# EAGLE design Feinstaubsensor_w (EAGLE 7.3.0)
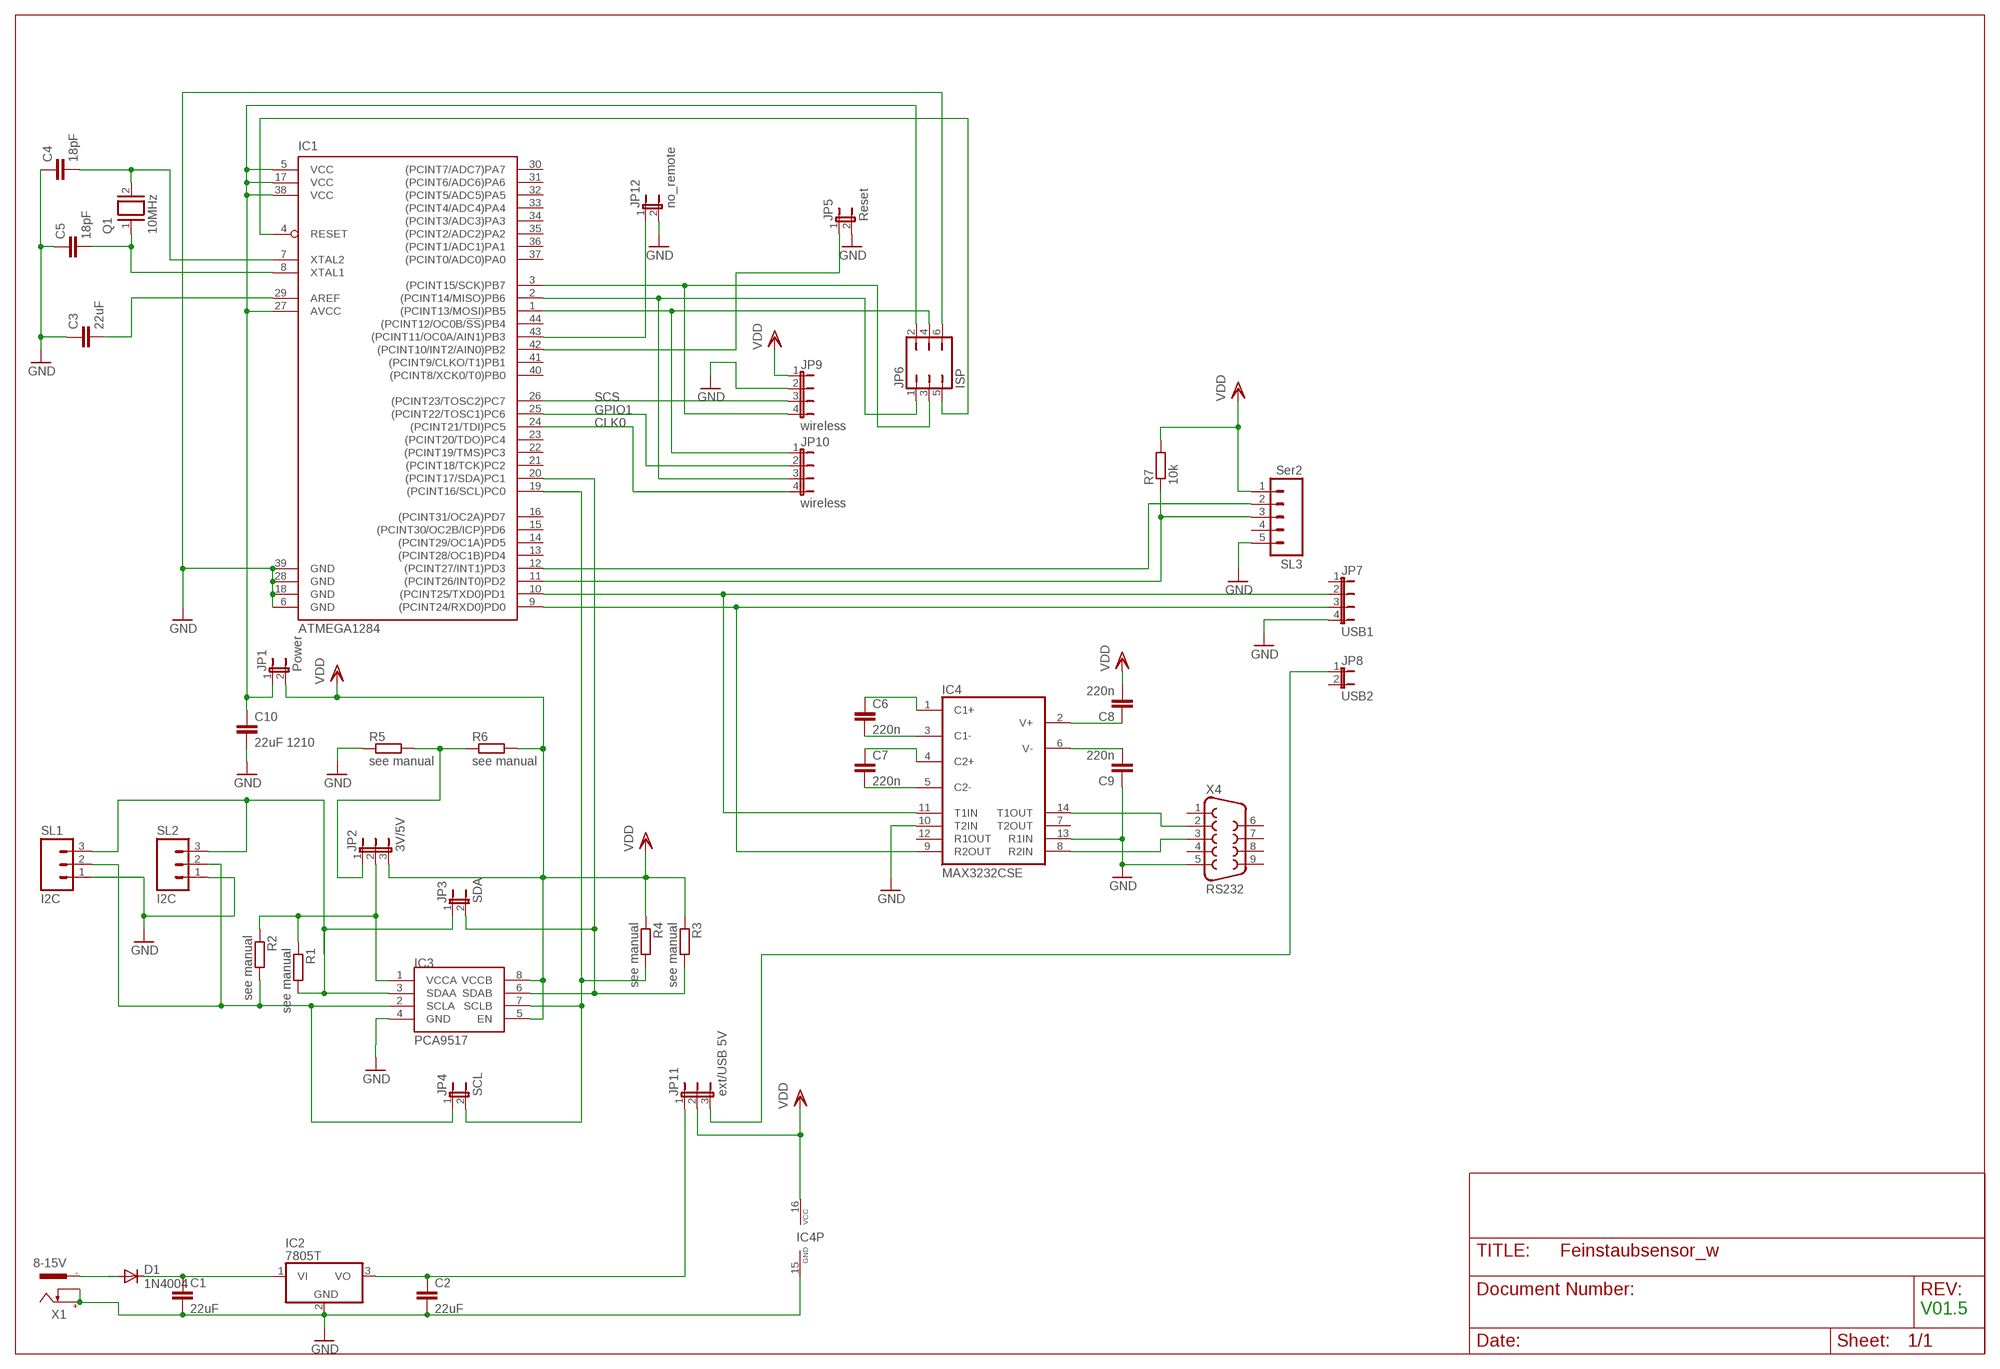
[diagram p0: schematic, sheet 1]

## Parts
C1  22uF  C-EUC1206  [C1206]
C2  22uF  C-EUC1206  [C1206]
C3  22uF  C-EUC1206  [C1206]
C4  18pF  C-EU025-025X050  [C025-025X050]
C5  18pF  C-EU025-025X050  [C025-025X050]
C6  220n  C-EUC1206  [C1206]
C7  220n  C-EUC1206  [C1206]
C8  220n  C-EUC1206  [C1206]
C9  220n  C-EUC1206  [C1206]
C10  22uF 1210  C-EUC1206  [C1206]
D1  1N4004  [DO41-10]
IC1  ATMEGA1284  ATMEGA644A  [TQFP44]
IC2  7805T  [TO220H]
IC3  PCA9517  [SO-08]
IC4  MAX3232CSE  [SO16]
JP1  Power  JP1E  [JP1]
JP2  3V/5V  JP2E  [JP2]
JP3  SDA  JP1E  [JP1]
JP4  SCL  JP1E  [JP1]
JP5  Reset  JP1E  [JP1]
JP6  ISP  JP3Q  [JP3Q]
JP7  USB1  JP4E  [JP4]
JP8  USB2  JP1E  [JP1]
JP9  wireless  JP4E  [JP4]
JP10  wireless  JP4E  [JP4]
JP11  ext/USB 5V  JP2E  [JP2]
JP12  no_remote  JP1E  [JP1]
Q1  10MHz  XTAL/S  [QS]
R1  see manual  R-EU_R1206  [R1206]
R2  see manual  R-EU_R1206  [R1206]
R3  see manual  R-EU_R1206  [R1206]
R4  see manual  R-EU_R1206  [R1206]
R5  see manual  R-EU_R1206  [R1206]
R6  see manual  R-EU_R1206  [R1206]
R7  10k  R-EU_R1206  [R1206]
SL1  I2C  M03  [03P]
SL2  I2C  M03  [03P]
SL3  Ser2  M05  [05P]
X1  8-15V  737992-55  [737992-5]
X4  RS232  F09H  [F09H]

## Nets
C13: C6.1 IC4.1(C1+)
CLK0: IC1.24((PCINT21/TDI)PC5) JP10.4
GND: C1.2 C2.2 C3.1 C4.1 C5.1 C9.1 C10.2 IC1.6(GND) IC1.18(GND) IC1.28(GND) IC1.39(GND) IC2.2(GND) IC3.4(GND) IC4.10(T2IN) IC4.13(R1IN) IC4.15(GND) JP5.2 JP6.6 JP7.4 JP9.2 JP12.2 R5.1 SL1.1 SL2.1 SL3.5 X1.+ X1.K X4.5
GPIO1: IC1.25((PCINT22/TOSC1)PC6) JP10.2
N$2: IC1.9((PCINT24/RXD0)PD0) IC4.9(R2OUT) JP7.3
N$3: C7.2 IC4.5(C2-)
N$4: JP2.1 R5.2 R6.1
N$5: IC1.20((PCINT17/SDA)PC1) IC3.6(SDAB) JP3.2 R3.2
N$7: C10.1 IC1.5(VCC) IC1.17(VCC) IC1.27(AVCC) IC1.38(VCC) JP1.1 JP6.2
N$8: C4.2 IC1.7(XTAL2) Q1.2
N$9: IC1.1((PCINT13/MOSI)PB5) JP6.4 JP10.1
N$10: IC4.14(T1OUT) X4.2
N$11: IC1.12((PCINT27/INT1)PD3) SL3.2
N$12: IC1.10((PCINT25/TXD0)PD1) IC4.11(T1IN) JP7.2
N$13: C7.1 IC4.4(C2+)
N$14: C6.2 IC4.3(C1-)
N$15: IC1.42((PCINT10/INT2/AIN0)PB2) JP5.1
N$16: C8.1 IC4.2(V+)
N$17: C9.2 IC4.6(V-)
N$18: IC1.4(RESET) JP6.5
N$19: IC1.11((PCINT26/INT0)PD2) R7.1 SL3.3
N$20: IC1.43((PCINT11/OC0A/AIN1)PB3) JP12.1
N$21: C5.2 IC1.8(XTAL1) Q1.1
N$22: IC1.19((PCINT16/SCL)PC0) IC3.7(SCLB) JP4.2 R4.2
N$23: IC3.3(SDAA) JP3.1 R1.2 SL1.3 SL2.3
N$24: C3.2 IC1.29(AREF)
N$25: IC3.2(SCLA) JP4.1 R2.2 SL1.2 SL2.2
N$26: IC1.3((PCINT15/SCK)PB7) JP6.3 JP9.4
N$27: D1.A X1.-1
N$29: IC1.2((PCINT14/MISO)PB6) JP6.1 JP10.3
N$31: C2.1 IC2.3(VO) JP11.1
N$32: IC3.1(VCCA) JP2.2 R1.1 R2.1
N$33: C1.1 D1.C IC2.1(VI)
N$36: JP8.1 JP11.3
N$41: IC4.8(R2IN) X4.3
SCS: IC1.26((PCINT23/TOSC2)PC7) JP9.3
VDD: C8.2 IC3.5(EN) IC3.8(VCCB) IC4.16(VCC) JP1.2 JP2.3 JP9.1 JP11.2 R3.1 R4.1 R6.2 R7.2 SL3.1
Unconnected: IC1.13((PCINT28/OC1B)PD4) IC1.14((PCINT29/OC1A)PD5) IC1.15((PCINT30/OC2B/ICP)PD6) IC1.16((PCINT31/OC2A)PD7) IC1.21((PCINT18/TCK)PC2) IC1.22((PCINT19/TMS)PC3) IC1.23((PCINT20/TDO)PC4) IC1.30((PCINT7/ADC7)PA7) IC1.31((PCINT6/ADC6)PA6) IC1.32((PCINT5/ADC5)PA5) IC1.33((PCINT4/ADC4)PA4) IC1.34((PCINT3/ADC3)PA3) IC1.35((PCINT2/ADC2)PA2) IC1.36((PCINT1/ADC1)PA1) IC1.37((PCINT0/ADC0)PA0) IC1.40((PCINT8/XCK0/T0)PB0) IC1.41((PCINT9/CLKO/T1)PB1) IC1.44((PCINT12/OC0B/!SS!)PB4) IC4.7(T2OUT) IC4.12(R1OUT) JP7.1 JP8.2 SL3.4 X1.-2 X4.1 X4.4 X4.6 X4.7 X4.8 X4.9

## Notes on the sheet
- V01.5

## Library data of the parts
C1-C3 C6-C10 = rcl:C-EU: CAPACITOR, European symbol
C4 C5 = resistor:C-EU: CAPACITOR, European symbol
D1 = diode:1N4004: DIODE general purpose rectifier, 1 A
IC1 = atmel:ATMEGA644: 8-bit Microcontroller with 64K Bytes In-System Programmable Flash Source: http://www.atmel.com/dyn/resources/prod_documents/doc2593.pdf; MPN: ATMEGA644PV-10AU; OC_FARNELL: 1455123; OC_NEWARK: 58M3748
IC2 = linear:78*: Positive VOLTAGE REGULATOR Source: http://cache.national.com/ds/LM/LM78L05.pdf http://www.fairchildsemi.com/ds/LM/LM7805.pdf
IC3 = PCA9517:PCA9517: PCA9517
IC4 = maxim:MAX3232*: True RS-232 Transceivers 3.0V to 5.5V, Low-Power up to 1Mbps, Using Four 0.1µF External Capacitors Source: http://pdfserv.maxim-ic.com/en/ds/MAX3222-MAX3241.pdf; MPN: MAX3232CSE; OC_FARNELL: 9725490; OC_NEWARK: 90C2890
JP1 JP3-JP5 JP8 JP12 = jumper:JP1E: JUMPER
JP2 JP11 = jumper:JP2E: JUMPER
JP6 = jumper:JP3Q: JUMPER
JP7 JP9 JP10 = jumper:JP4E: JUMPER
Q1 = special:XTAL/S: CRYSTAL
R1-R7 = resistor:R-EU_: RESISTOR, European symbol
SL1 SL2 = con-amp-quick:M03: AMP QUICK CONNECTOR; OC_FARNELL: unknown; OC_NEWARK: unknown
SL3 = con-amp-quick:M05: AMP QUICK CONNECTOR; OC_FARNELL: unknown; OC_NEWARK: unknown
X1 = con-conrad:737992-55: FEMALE PRINT CONNECTOR DIN 45323 (34V/3A), ROKA, distributor Conrad
X4 = con-subd:F09: SUB-D; OC_FARNELL: unknown; OC_NEWARK: unknown

## Board
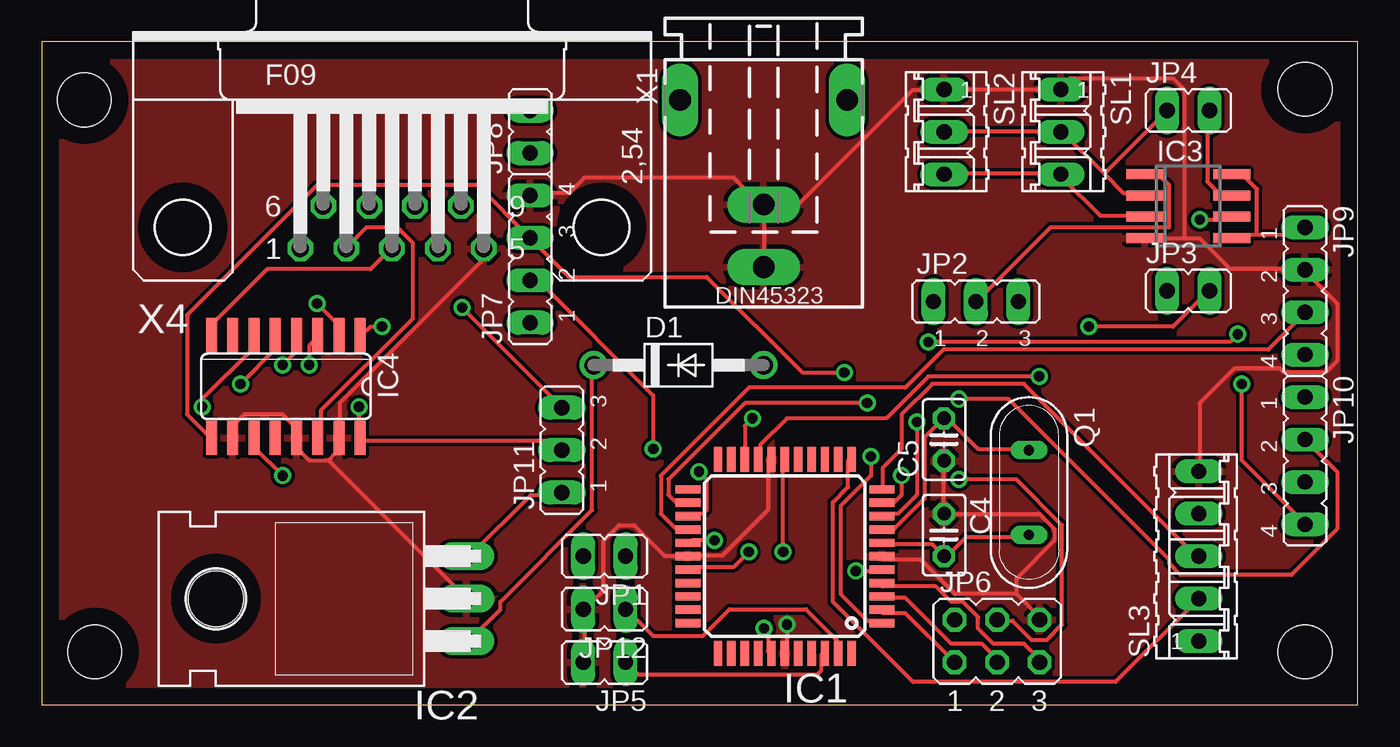
[diagram p1: board, top side]
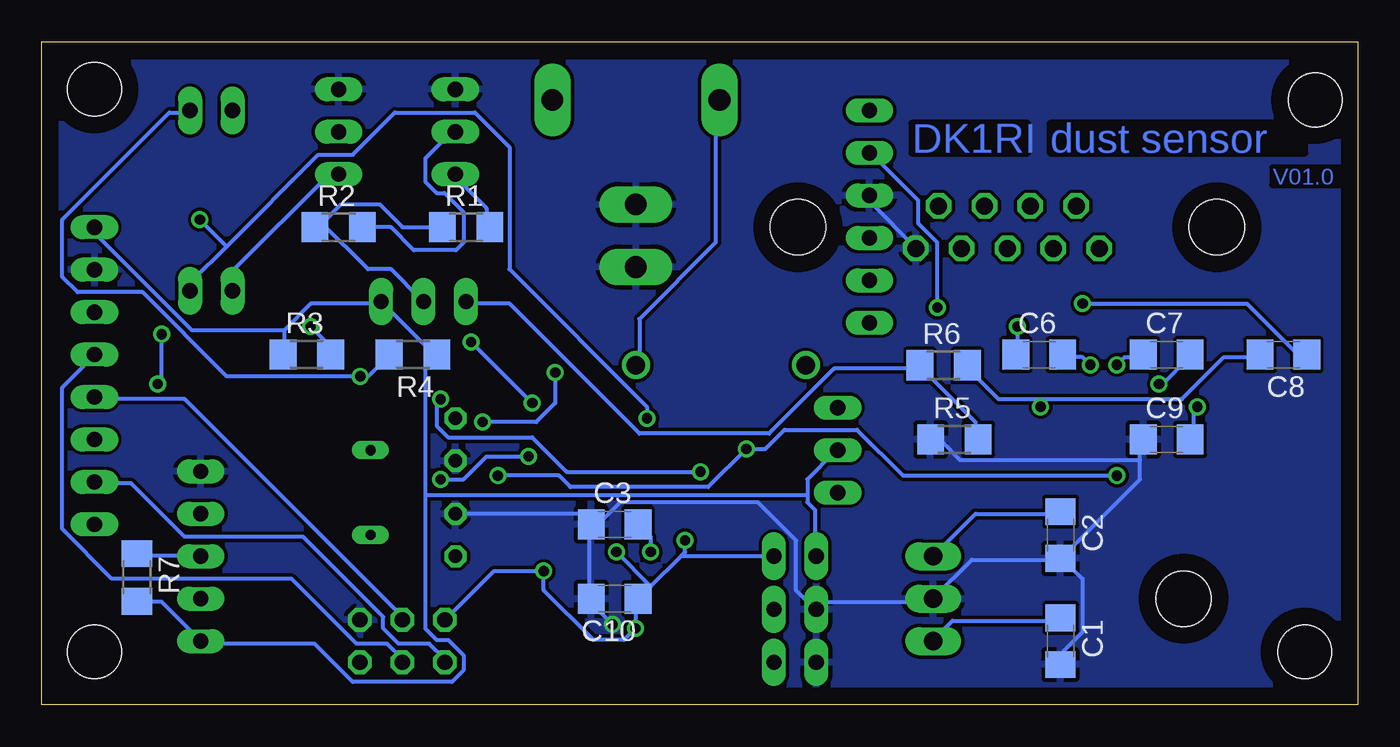
[diagram p2: board, bottom side, seen from below]

Size 78.72 x 39.67 mm. Coordinates in mm from the lower left corner, seen from the top.
Outline: 0,0 78.72,0 78.72,39.67 0,39.67 0,0
Copper layers (1*16): Top 0.035mm / dielectric 1.5mm / Bottom 0.035mm
Design rules "default": minimum track width 10mil, minimum drill 24mil, track to track 8mil, track to pad 8mil, pad to pad 8mil, via to via 8mil, smd to smd 8mil, copper to edge 40mil, drill to drill 8mil, minimum pad ring 10mil, minimum via ring 8mil, stop-mask expansion 4mil, vias tented up to drill 0mil, thermal gap 10mil
Holes 3.2 mm at 75.56,36.83 75.56,3.17 3.17,3.17 2.54,36.2

### Footprints (pad centres in the part's own frame; a part is rotated, then mirrored left to right if it is on the bottom)
C1206 = smd 1.6 x 1.8: 1 -1.4,0; 2 1.4,0
C025-025X050 = drill 0.813 octagon: 1 -1.27,0; 2 1.27,0
DO41-10 = drill 1.118: A 5.08,0; C -5.08,0
TQFP44 = smd 1.5 x 0.5: 1 -5.8,4; 2 -5.8,3.2; 3 -5.8,2.4; 4 -5.8,1.6; 5 -5.8,0.8; 6 -5.8,0; 7 -5.8,-0.8; 8 -5.8,-1.6; 9 -5.8,-2.4; 10 -5.8,-3.2; 11 -5.8,-4; 23 5.8,-4; 24 5.8,-3.2; 25 5.8,-2.4; 26 5.8,-1.6; 27 5.8,-0.8; 28 5.8,0; 29 5.8,0.8; 30 5.8,1.6; 31 5.8,2.4; 32 5.8,3.2; 33 5.8,4 | smd 0.5 x 1.5: 12 -4,-5.8; 13 -3.2,-5.8; 14 -2.4,-5.8; 15 -1.6,-5.8; 16 -0.8,-5.8; 17 0,-5.8; 18 0.8,-5.8; 19 1.6,-5.8; 20 2.4,-5.8; 21 3.2,-5.8; 22 4,-5.8; 34 4,5.8; 35 3.2,5.8; 36 2.4,5.8; 37 1.6,5.8; 38 0.8,5.8; 39 0,5.8; 40 -0.8,5.8; 41 -1.6,5.8; 42 -2.4,5.8; 43 -3.2,5.8; 44 -4,5.8
TO220H = drill 1.118 long: 1 -2.54,-10.16; 2 0,-10.16; 3 2.54,-10.16 | hole 3.302: 0,4.826
SO-08 = smd 0.6 x 2.2: 1 -1.905,-2.6; 2 -0.635,-2.6; 3 0.635,-2.6; 4 1.905,-2.6; 5 1.905,2.6; 6 0.635,2.6; 7 -0.635,2.6; 8 -1.905,2.6
SO16 = smd 0.66 x 2.032: 1 -4.445,-3.073; 2 -3.175,-3.073; 3 -1.905,-3.073; 4 -0.635,-3.073; 5 0.635,-3.073; 6 1.905,-3.073; 7 3.175,-3.073; 8 4.445,-3.073; 9 4.445,3.073; 10 3.175,3.073; 11 1.905,3.073; 12 0.635,3.073; 13 -0.635,3.073; 14 -1.905,3.073; 15 -3.175,3.073; 16 -4.445,3.073
JP1 = drill 0.914 long: 1 0,-1.27; 2 0,1.27
JP2 = drill 0.914 long: 1 -2.54,0; 2 0,0; 3 2.54,0
JP3Q = drill 0.914 octagon: 1 -2.54,-1.27; 2 -2.54,1.27; 3 0,-1.27; 4 0,1.27; 5 2.54,-1.27; 6 2.54,1.27
JP4 = drill 0.914 long: 1 -3.81,0; 2 -1.27,0; 3 1.27,0; 4 3.81,0
QS = drill 0.61 long: 1 -2.54,0; 2 2.54,0
R1206 = smd 1.6 x 1.803: 1 -1.422,0; 2 1.422,0
03P = drill 0.914 long: 1 -2.54,0; 2 0,0; 3 2.54,0
05P = drill 0.914 long: 1 -5.08,0; 2 -2.54,0; 3 0,0; 4 2.54,0; 5 5.08,0
737992-5 = drill 1.3 pad 2.184 long: + 0,10; -1 5,0; -2 -5,0; K 0,6.25
F09H = drill 1.016 octagon: 1 -5.486,-1.27; 2 -2.743,-1.27; 3 0,-1.27; 4 2.743,-1.27; 5 5.486,-1.27; 6 -4.115,1.27; 7 -1.372,1.27; 8 1.372,1.27; 9 4.115,1.27 | hole 3.302: -12.522,0; 12.522,0

### Placement (x,y rotation side)
C1  17.78,3.81 270 bottom
C2  17.78,10.16 270 bottom
C3  44.45,10.79 0 bottom
C4  53.98,10.16 270 top
C5  53.98,15.88 90 top
C6  19.05,20.95 0 bottom
C7  11.43,20.95 0 bottom
C8  4.45,20.95 180 bottom
C9  11.43,15.88 0 bottom
C10  44.45,6.35 180 bottom
D1  38.1,20.32 0 top
IC1  44.45,8.89 180 top
IC2  15.24,6.35 90 top
IC3  68.58,29.84 270 top
IC4  14.61,19.05 180 top
JP1  33.66,8.89 90 top
JP2  55.88,24.13 0 top
JP3  68.58,24.77 270 top
JP4  68.58,35.56 270 top
JP5  33.66,2.54 90 top
JP6  57.15,3.81 0 top
JP7  29.21,26.67 90 top
JP8  29.21,34.29 0 top
JP9  75.56,24.77 270 top
JP10  75.56,14.61 270 top
JP11  31.11,15.24 90 top
JP12  33.66,5.71 90 top
Q1  59.05,12.7 270 top
R1  53.34,28.57 0 bottom
R2  60.96,28.57 0 bottom
R3  62.87,20.95 0 bottom
R4  56.52,20.95 180 bottom
R5  24.13,15.88 0 bottom
R6  24.77,20.32 0 bottom
R7  73.03,7.62 270 bottom
SL1  60.96,34.29 270 top
SL2  53.98,34.29 270 top
SL3  69.22,8.89 90 top
X1  43.18,36.2 180 top
X4  20.95,28.57 0 top

### Tracks (layer width: path | path; a pad name or v marks a point on that pad's centre or on a via)
C13  (via drill 0.61)
  Top 0.254: v20.34,22.63 19.66,22.63 19.2,22.17 IC4.1
  Bottom 0.254: v20.34,22.63 20.34,21.03 C6.1
CLK0  (via drill 0.61)
  Top 0.254: v49.38,18.06 42.06,18.06 37.49,13.49 37.49,12.57 37.95,12.12 38.63,12.12 IC1.24 | v53.03,21.72 71.09,21.72 v71.55,22.17 | v71.78,19.2 71.78,14.63 75.44,10.97 JP10.4
  Bottom 0.254: v53.03,21.72 v49.38,18.06 | v71.55,22.17 71.55,19.43 v71.78,19.2
GND  (via drill 0.61)
  Top 0.254: 58.29,6.63 54.63,6.63 52.58,8.69 50.29,8.69 IC1.6 | 58.29,6.63 59.66,5.26 JP6.6 | C5.1 53.95,14.4 53.95,11.43 C4.1 59.66,11.43 60.58,10.52 60.58,9.83 58.29,7.54 58.29,6.63 | v44.58,4.8 44.58,3.2 IC1.39 | IC1.18 43.43,14.63 43.43,11.66 40.69,8.91 38.86,8.91 IC1.28 38.63,8.91 37.26,8.91 35.43,10.74 34.52,10.74 33.6,9.83 33.6,6.86 32.46,5.71 | IC4.10 11.43,16.69 12.12,17.37 14.4,17.37 15.09,16.69 15.09,16 IC4.13 15.32,15.77 15.32,15.32 16,14.63 17.14,14.63 | 17.14,14.63 17.6,15.09 17.6,15.77 IC4.15 17.83,16 17.83,18.06 26.29,26.52 26.29,27.2 X4.5 | 32.46,5.71 32.46,2.74 JP5.2 | 17.14,14.63 25.38,6.4 IC2.2 | 32.46,5.71 JP12.2 | 68.35,27.89 69.27,27.89 71.09,26.06 75.44,26.06 JP9.2 75.67,25.83 77.5,24 77.5,20.57 76.81,19.89 74.3,19.89 74.07,20.12 71.32,20.12 69.27,18.06 69.27,14.17 SL3.5 | 68.35,27.89 66.06,27.89 IC3.4 | X1.+ 43.2,26.29 43.2,29.72 X1.K | JP7.4 29.26,30.63 31.55,30.63 32.46,31.55 41.38,31.55 42.98,29.95 X1.K | X1.K 43.2,29.95 45.26,29.95 52.12,36.8 53.95,36.8 SL2.1 54.18,36.8 60.81,36.8 SL1.1 61.04,37.03 61.49,37.49 67.67,37.49 68.35,36.8 68.35,27.89
  Bottom 0.254: v44.58,4.8 45.95,6.17 C10.2 45.95,6.4 45.95,10.74 C3.1 | C4.1 46.41,11.43 45.95,10.97 C3.1 | C1.2 17.6,2.52 17.6,3.2 16.46,4.34 16.46,7.54 17.6,8.69 C2.2 | 13.03,14.63 13.03,13.49 17.6,8.91 C2.2 | 13.03,14.63 13.03,15.77 C9.1 | 13.03,14.63 23.77,14.63 24.92,15.77 25.38,15.77 R5.1 | C2.2 17.83,8.69 23.09,8.69 25.38,6.4 IC2.2 25.6,6.17 31.77,6.17 32.23,5.71 JP12.2 32.46,5.71 33.6,6.86 33.6,9.83 35.89,12.12 44.12,12.12 45.26,10.97 45.72,10.97 C3.1 | JP7.4 29.03,30.4 29.03,29.95 26.52,27.43 X4.5
  pour Top: 0.64,38.73 78.11,38.73 78.11,0.64 0.64,0.64
  pour Bottom: 0.64,38.73 78.11,38.73 78.11,0.64 0.64,0.64
GPIO1  (via drill 0.61)
  Top 0.254: v39.32,13.95 39.78,13.49 39.78,11.66 39.55,11.43 38.86,11.43 IC1.25 | v54.86,18.29 57.84,18.29 67.44,8.69 67.44,8.46 68.12,7.77 74.75,7.77 77.5,10.52 77.5,13.95 JP10.2
  Bottom 0.254: v39.32,13.95 47.32,13.95 49.38,16 54.41,16 55.09,16.69 55.09,18.06 v54.86,18.29
N$2  (via drill 0.61)
  Top 0.254: v52.35,16.92 52.35,12.57 51.21,11.43 50.29,11.43 IC1.9 | v48.01,19.89 45.49,19.89 39.78,25.6 31.55,25.6 JP7.3 26.06,31.09 16.46,31.09 8.69,23.32 8.69,17.37 10.06,16 IC4.9
  Bottom 0.254: v52.35,16.92 49.15,16.92 48.01,18.06 v48.01,19.89
N$3  (via drill 0.61)
  Top 0.254: v11.89,19.2 13.95,21.26 13.95,21.95 IC4.5
  Bottom 0.254: v11.89,19.2 11.66,19.2 10.06,20.8 C7.2
N$4
  Bottom 0.254: R5.2 22.86,16 22.86,16.92 26.06,20.12 R6.1 26.29,20.12 31.32,20.12 35.2,16.23 42.98,16.23 50.75,24 53.26,24 JP2.1
N$5  (via drill 0.61)
  Top 0.254: v42.52,17.14 42.06,16.69 42.06,14.86 IC1.20 | v62.64,22.63 67.67,22.63 69.72,24.69 JP3.2 | v69.27,29.03 71.09,29.03 IC3.6
  Bottom 0.254: v42.52,17.14 42.52,17.83 50.75,26.06 50.75,33.38 52.81,35.43 57.61,35.43 60.12,32.92 62.18,32.92 67.67,27.43 | 67.67,27.43 69.72,25.38 69.72,24.92 JP3.2 | v62.64,22.63 61.49,21.49 61.49,21.03 R3.2 | 67.67,27.43 v69.27,29.03
N$7  (via drill 0.61)
  Top 0.254: v48.69,8 50.06,8 IC1.5 | v40.23,9.83 38.86,9.83 IC1.27 | v43.2,4.57 43.43,4.34 43.43,3.2 IC1.38 | v44.35,9.14 44.35,14.63 IC1.17
  Bottom 0.254: JP6.2 54.41,5.26 51.66,8 v48.69,8 48.69,6.86 45.72,3.89 43.89,3.89 v43.2,4.57 43.2,6.17 C10.1 | v40.23,9.83 40.23,9.14 40.46,8.91 | 42.29,7.09 42.98,6.4 C10.1 | 42.29,7.09 40.46,8.91 | 42.29,7.09 v44.35,9.14 | 42.29,7.09 C10.1 | 40.46,8.91 34.98,8.91 JP1.1
N$8
  Top 0.254: IC1.7 50.29,9.6 53.26,9.6 C4.2 54.18,8.91 55.32,10.06 58.98,10.06 Q1.2
N$9  (via drill 0.61)
  Top 0.254: v49.61,14.86 49.61,13.72 47.78,11.89 47.78,6.63 49.38,5.03 50.06,5.03 IC1.1 | v54.86,13.49 58.29,13.49 61.04,10.74 61.04,4.8 60.12,3.89 59.21,3.89 58.06,5.03 57.15,5.03 JP6.4
  Bottom 0.254: v49.61,14.86 52.12,14.86 53.49,13.49 v54.86,13.49 | JP10.1 75.44,18.29 70.18,18.29 57.15,5.26 JP6.4
N$10
  Top 0.254: IC4.14 16.69,16 16.69,17.6 22.17,23.09 22.17,27.66 21.26,28.57 19.43,28.57 18.29,27.43 X4.2
N$11
  Top 0.254: SL3.2 64.24,1.37 52.12,1.37 47.32,6.17 47.32,12.12 48.23,13.03 48.23,14.63 IC1.12
N$12  (via drill 0.61)
  Top 0.254: v51.44,13.72 51.44,12.57 50.98,12.12 50.29,12.12 IC1.10 | v36.58,15.32 36.58,18.52 29.72,25.38 29.26,25.38 JP7.2 | v14.4,13.72 12.8,15.32 12.8,15.77 IC4.11
  Bottom 0.254: v51.44,13.72 47.78,13.72 47.09,13.03 38.86,13.03 v36.58,15.32 35.43,15.32 34.29,16.46 29.95,16.46 27.2,13.72 v14.4,13.72
N$13  (via drill 0.61)
  Top 0.254: v14.4,20.34 15.09,21.03 15.09,21.95 IC4.4
  Bottom 0.254: v14.4,20.34 13.95,20.8 13.03,20.8 C7.1
N$14  (via drill 0.61)
  Top 0.254: v16,20.34 16,21.49 16.46,21.95 IC4.3
  Bottom 0.254: v16,20.34 16.46,20.8 17.6,20.8 C6.2
N$15
  Top 0.254: IC1.42 46.63,2.97 46.63,2.06 46.41,1.83 35.66,1.83 34.98,2.52 JP5.1
N$16  (via drill 0.61)
  Top 0.254: v16.46,24 17.6,22.86 17.6,22.17 IC4.2
  Bottom 0.254: v16.46,24 6.63,24 3.66,21.03 3.2,21.03 C8.1
N$17  (via drill 0.61)
  Top 0.254: v9.6,17.83 9.6,18.29 12.57,21.26 12.57,21.95 IC4.6
  Bottom 0.254: v9.6,17.83 9.83,17.6 9.83,16 C9.2
N$18
  Top 0.254: IC1.4 50.29,7.09 53.49,7.09 54.41,6.17 55.09,6.17 56.01,5.26 56.01,4.57 56.92,3.66 58.75,3.66 59.66,2.74 JP6.5
N$19
  Top 0.254: IC1.11 50.29,13.03 50.29,14.17 51.44,15.32 51.44,17.37 53.26,19.2 58.75,19.2 69.04,8.91 SL3.3
  Bottom 0.254: R7.1 72.92,8.91 69.27,8.91 SL3.3
N$20
  Top 0.254: IC1.43 47.55,3.2 47.55,3.89 45.72,5.71 41.15,5.71 39.55,4.12 36.58,4.12 34.98,5.71 JP12.1
N$21
  Top 0.254: IC1.8 50.29,10.52 50.98,10.52 52.81,12.34 52.81,16 53.95,17.14 C5.2 54.18,17.14 56.01,15.32 58.98,15.32 Q1.1
N$22  (via drill 0.61)
  Top 0.254: IC3.7 71.09,30.63 70.41,30.63 69.72,31.32 69.72,35.43 JP4.2 | v59.66,19.66 53.03,19.66 50.52,17.14 44.58,17.14 42.98,15.54 42.98,14.86 IC1.19
  Bottom 0.254: R4.2 58.06,20.8 59.21,19.66 v59.66,19.66 67.67,19.66 72.69,24.69 76.58,24.69 77.5,25.6 77.5,29.03 71.09,35.43 69.95,35.43 JP4.2
N$23
  Top 0.254: IC3.3 65.84,29.26 63.32,29.26 61.04,31.55 SL1.3 60.81,31.77 54.18,31.77 SL2.3
  Bottom 0.254: R1.2 52.12,28.57 52.12,29.72 53.95,31.55 SL2.3 | JP3.1 67.21,24.92 67.21,26.06 61.72,31.55 61.04,31.55 SL1.3
N$24  (via drill 0.61)
  Top 0.254: v42.29,9.14 41.38,8.23 38.86,8.23 IC1.29
  Bottom 0.254: v42.29,9.14 42.29,10.06 42.98,10.74 C3.2
N$25
  Top 0.254: 63.55,31.77 61.04,34.29 SL1.2 SL2.2 | 63.55,31.77 64.69,30.63 65.84,30.63 IC3.2 | 63.55,31.77 67.21,35.43 JP4.1
  Bottom 0.254: R2.2 57.84,28.57 56.46,27.2 53.95,27.2 53.49,27.66 53.49,29.49 54.63,30.63 55.09,30.63 55.78,31.32 55.78,32.69 54.18,34.29 SL2.2
N$26
  Top 0.254: IC1.3 50.29,6.4 51.66,6.4 54.41,3.66 56.24,3.66 57.15,2.74 JP6.3
  Bottom 0.254: JP9.4 75.67,20.8 77.5,18.97 77.5,10.52 74.52,7.54 63.78,7.54 59.89,3.66 58.06,3.66 57.15,2.74 JP6.3
N$27
  Bottom 0.254: D1.A 42.98,20.34 42.98,23.09 38.41,27.66 38.41,36.12 X1.-1
N$29
  Top 0.254: JP6.1 51.66,5.49 50.29,5.49 IC1.2
  Bottom 0.254: JP10.3 75.44,13.26 73.38,13.26 70.18,10.06 63.09,10.06 58.29,5.26 58.29,4.57 57.38,3.66 55.55,3.66 54.63,2.74 JP6.1
N$31
  Top 0.254: JP11.1 31.09,12.57 29.26,12.57 25.6,8.91 IC2.3
  Bottom 0.254: IC2.3 22.86,11.43 17.83,11.43 C2.1
N$32
  Top 0.254: IC3.1 66.06,31.55 66.98,31.55 67.44,31.09 67.44,28.57 60.35,28.57 56.01,24.23 JP2.2
  Bottom 0.254: R1.1 57.15,28.57 58.52,29.95 60.81,29.95 61.95,28.8 | 61.95,28.8 62.18,28.57 R2.1 61.95,28.8 | 61.95,28.8 59.21,26.06 57.84,26.06 56.01,24.23 JP2.2
N$33
  Top 0.254: D1.C 32.92,20.12 32.92,11.66 27.43,6.17 27.43,5.71 25.6,3.89 IC2.1
  Bottom 0.254: C1.1 17.83,5.03 24.23,5.03 25.38,3.89 IC2.1
N$36  (via drill 0.61)
  Top 0.254: v25.15,23.77 31.09,17.83 JP11.3
  Bottom 0.254: v25.15,23.77 25.15,27.66 26.29,28.8 26.29,30.18 29.03,32.92 JP8.1
N$41
  Top 0.254: IC4.8 10.29,22.17 10.29,22.86 13.49,26.06 19.66,26.06 20.8,27.2 X4.3
SCS
  Top 0.254: IC1.26 38.63,10.52 37.95,10.52 37.03,11.43 37.03,13.72 42.29,18.97 51.66,18.97 53.95,21.26 73.38,21.26 75.44,23.32 JP9.3
VDD  (via drill 0.61)
  Top 0.254: JP11.2 31.09,15.32 30.63,15.77 19.2,15.77 IC4.16 18.97,16 v18.97,17.83 | 72.69,28.12 74.98,28.12 75.44,28.57 JP9.1 | 72.69,28.12 71.32,28.12 IC3.5 | 72.69,28.12 72.69,30.86 72.01,31.55 71.32,31.55 IC3.8
  Bottom 0.254: 18.97,18.29 21.49,18.29 23.32,20.12 R6.2 | 18.97,18.29 10.52,18.29 8,20.8 5.94,20.8 C8.2 | 32.92,12.57 32.92,13.49 31.32,15.09 JP11.2 | 32.92,12.57 32.92,12.12 32.46,11.66 32.46,8.91 JP1.2 | v18.97,17.83 18.97,18.29 | R7.2 72.92,6.17 71.55,6.17 69.27,3.89 SL3.1 69.04,3.66 62.41,3.66 60.12,1.37 54.18,1.37 53.49,2.06 53.49,2.97 54.41,3.89 55.09,3.89 55.78,4.57 55.78,12.57 | 64.24,22.4 64.24,21.03 R3.1 | 64.24,22.4 62.64,24 58.52,24 JP2.3 55.32,21.03 R4.1 55.32,20.8 55.78,20.34 55.78,12.57 | 64.24,22.4 69.72,22.4 75.44,28.12 75.44,28.57 JP9.1 | 55.78,12.57 32.92,12.57

### Text on the board
Bottom: dust sensor | DK1RI | V01.0